# EAGLE design relais platine v3 (EAGLE 6.1)
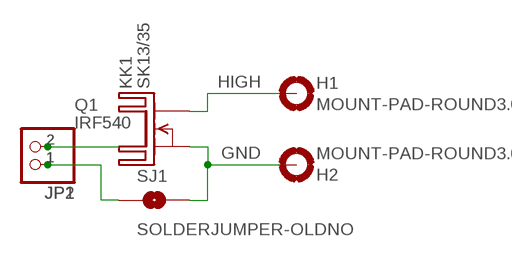
[diagram p0: schematic, sheet 1]

## Parts
H1  MOUNT-PAD-ROUND3.0  [3,0-PAD]
H2  MOUNT-PAD-ROUND3.0  [3,0-PAD]
JP1  PINHD-1X2  [1X02]
JP2  PINHD-1X2/90  [1X02/90]
KK1  SK13/35  [SK13/35]
Q1  IRF540  [TO220]
SJ1  SOLDERJUMPER-OLDNO  [SJ_2S-NO]

## Nets
GND: H2.B3,0(MOUNT) Q1.3(S) SJ1.2
HIGH: H1.B3,0(MOUNT) Q1.2(D)
N$1: JP1.1 JP2.1 SJ1.1
N$2: JP1.2 JP2.2 Q1.1(G)

## Library data of the parts
H1 H2 = holes:MOUNT-PAD-ROUND: MOUNTING PAD, round
JP1 JP2 = pinhead:PINHD-1X2: PIN HEADER
KK1 = heatsink:SK13/35: HEATSINK manufacturer Fischer/distributor Buerklin
Q1 = transistor-fet:IRF540: N-Channel Enhancement MOSFET (HEXFET); 100V; 28A; 0,077Ohm
SJ1 = SparkFun-Retired:SOLDERJUMPER-OLD: Solder Jumper Standard SMD solder jumper. Used to automate production. Two varients : Normally Open and Normally Closed are the same, but have different paste layers. NC will have a large amount of paste and should jumper during reflow.

## Board
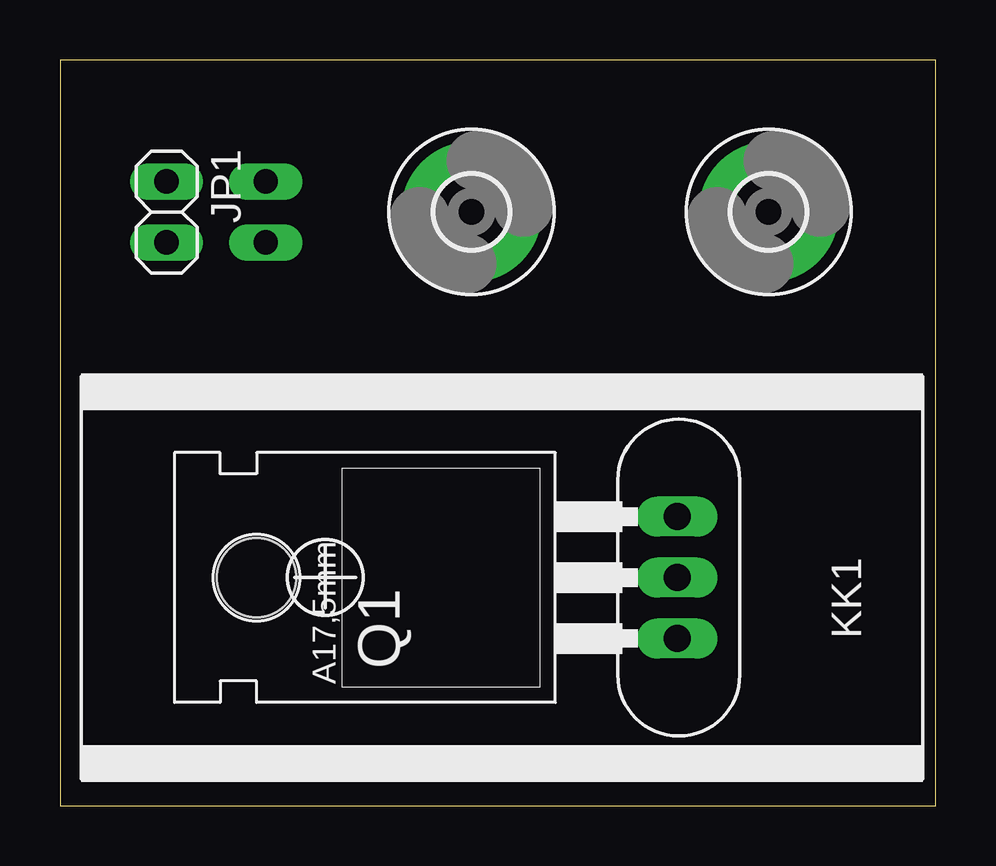
[diagram p1: board, top side]
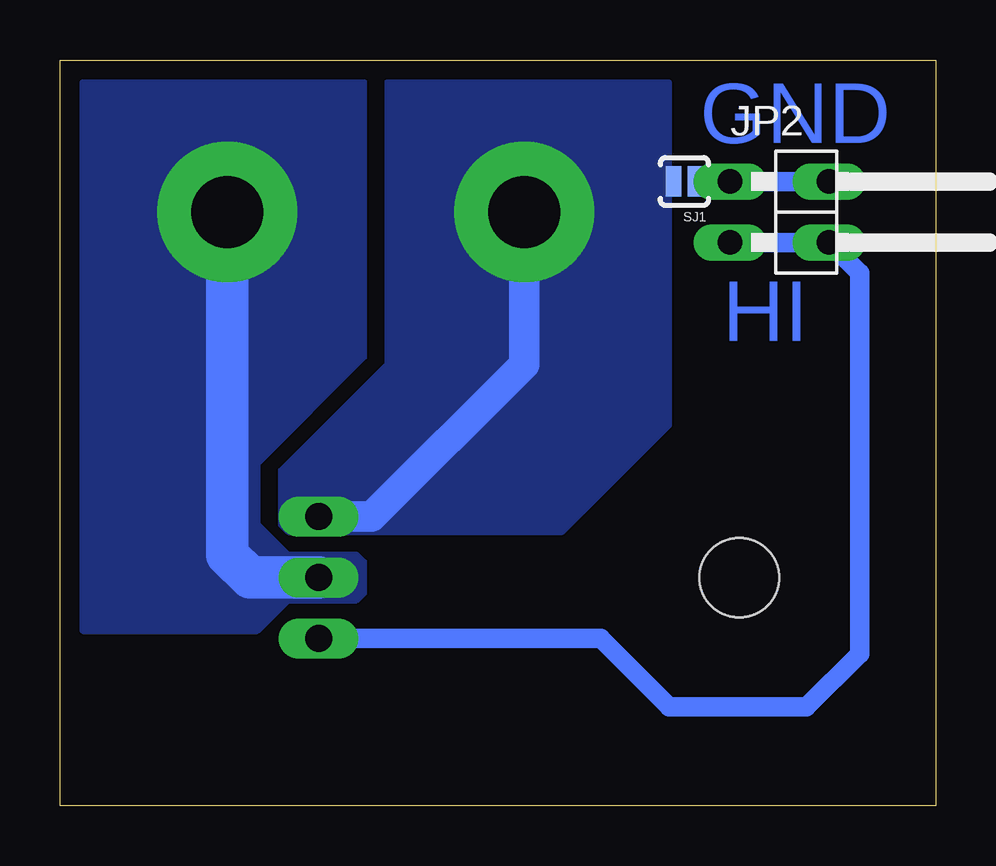
[diagram p2: board, bottom side, seen from below]

Size 36.49 x 31.1 mm. Coordinates in mm from the lower left corner, seen from the top.
Outline: 0,0 36.49,0 36.49,31.1 0,31.1 0,0
Copper layers (1*16): Top 0.035mm / dielectric 1.5mm / Bottom 0.035mm
Design rules: minimum track width 10mil, minimum drill 24mil, track to track 12mil, track to pad 12mil, pad to pad 12mil, via to via 12mil, smd to smd 10mil, copper to edge 12mil, drill to drill 12mil, minimum pad ring 10mil, minimum via ring 10mil, stop-mask expansion 4mil, vias tented up to drill 0mil, thermal gap 12mil

### Footprints (pad centres in the part's own frame; a part is rotated, then mirrored left to right if it is on the bottom)
3,0-PAD = drill 3 pad 5.842: B3,0 0,0
1X02 = drill 1.016 long: 1 -1.27,0; 2 1.27,0
1X02/90 = drill 1.016 long: 1 -1.27,-3.81; 2 1.27,-3.81
TO220 = drill 1.118 long: 1 -2.54,-6.35; 2 0,-6.35; 3 2.54,-6.35 | hole 3.302: 0,11.176
SJ_2S-NO = smd 0.635 x 1.27: 1 -0.45,0; 2 0.45,0

### Placement (x,y rotation side)
H1  29.53,24.77 0 top
H2  17.14,24.77 0 top
JP1  4.45,24.77 270 top
JP2  4.76,24.77 270 bottom
KK1  22.23,9.53 0 top
Q1  19.37,9.53 90 top
SJ1  10.48,26.04 180 bottom

### Tracks (layer width: path | path; a pad name or v marks a point on that pad's centre or on a via)
GND
  Bottom 0.813: 15.88,26.04 H2.B3,0
  Bottom 1.27: Q1.3 23.5,12.06 17.14,18.41 H2.B3,0
  pour Bottom (no thermals): 22.86,30.16 22.86,18.41 27.3,13.97 27.3,11.75 26.99,11.43 15.56,11.43 11.11,15.88 11.11,30.16
HIGH
  Bottom 1.778: Q1.2 28.57,9.53 29.53,10.48 H1.B3,0
  pour Bottom (no thermals): 24.13,10.48 26.99,10.48 28.26,11.75 28.26,14.29 23.81,18.73 23.81,30.16 35.56,30.16 35.56,7.3 28.26,7.3 26.99,8.57 24.13,8.57 23.81,8.89 23.81,10.16
N$1
  Bottom 0.61: SJ1.1 JP2.1
  Bottom 0.813: JP1.1 JP2.1 9.84,26.04
N$2
  Bottom 0.813: JP2.2 JP1.2 3.17,22.23 3.17,6.35 5.4,4.13 11.11,4.13 13.97,6.99 Q1.1

### Text on the board
Bottom: GND | HI